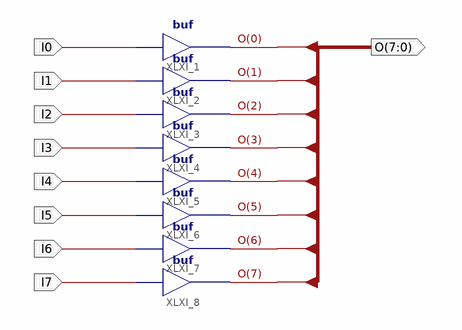
[diagram p0: schematic sheet 1]
// Xilinx ISE schematic wtb8.sch (spartan6) as structural Verilog: 8 symbols, 9 ports
module wtb8 (
  input  I0,
  input  I1,
  input  I2,
  input  I3,
  input  I4,
  input  I5,
  input  I6,
  input  I7,
  output [7:0] O
);

  buf XLXI_1 (O[0], I0);
  buf XLXI_2 (O[1], I1);
  buf XLXI_3 (O[2], I2);
  buf XLXI_4 (O[3], I3);
  buf XLXI_5 (O[4], I4);
  buf XLXI_6 (O[5], I5);
  buf XLXI_7 (O[6], I6);
  buf XLXI_8 (O[7], I7);
endmodule
